# Altium schematic sheet ECL_Fanout.SchDoc
size A4; ApprovedBy: Mateusz Kowalik; CheckedBy: Mateusz Kowalik; Author: Mateusz Kowalik; CompanyName: InMotion Labs sp. z o.o.; DrawnBy: Mateusz Kowalik; Engineer: Mateusz Kowalik; Organization: InMotion Labs sp. z o.o.; Address1: Rydlówka 5A; Address2: 30-363 Kraków; Address4: Poland; Revision: Rev 0; SheetNumber: 14; SheetTotal: 16
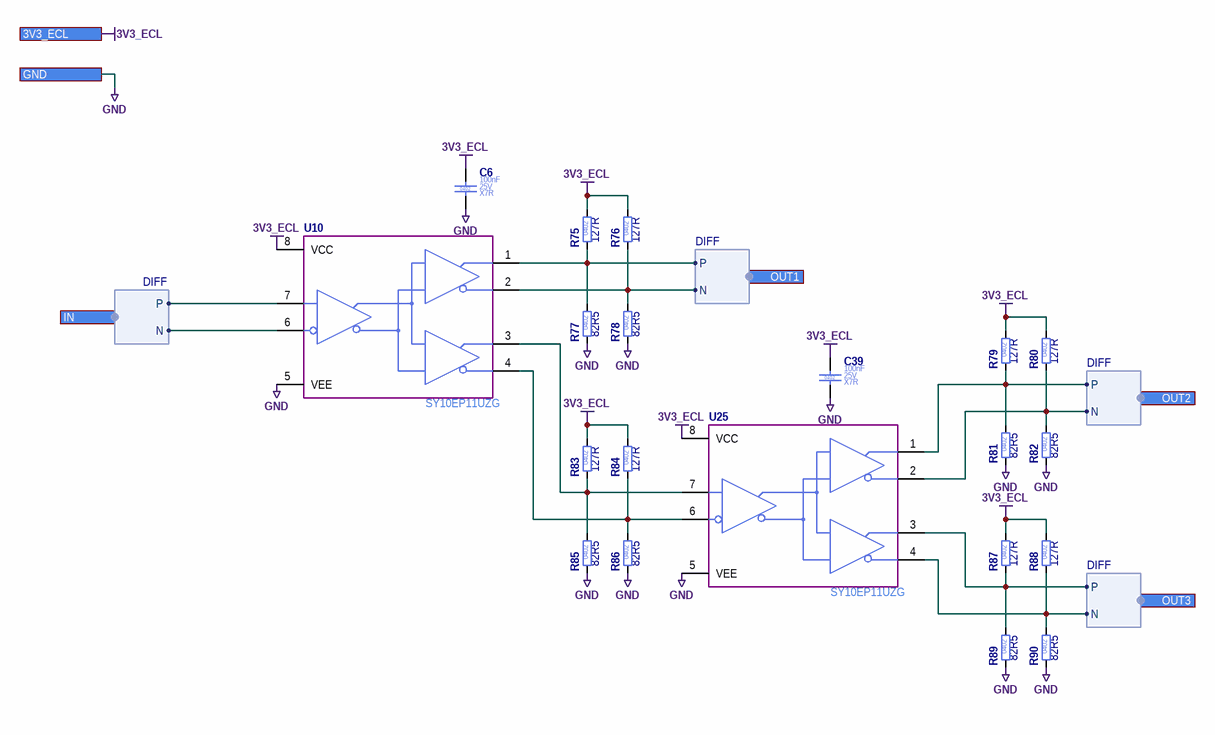
[diagram p0: ECL_Fanout.SchDoc]

## Parts
C6  Case/Package: 0402  Voltage Rating (DC): 25V  Dielectric: X7R  Capacitance: 100nF  [C_0402_1005]  (hidden comment: C_100NF_25V_X7R_0402_10)
C39  Case/Package: 0402  Voltage Rating (DC): 25V  Dielectric: X7R  Capacitance: 100nF  [C_0402_1005]  (hidden comment: C_100NF_25V_X7R_0402_10)
R75  Resistance: 127R  Case/Package: 0402  [R_0402_1005]  (hidden comment: R_127R_0402_1)
R76  Resistance: 127R  Case/Package: 0402  [R_0402_1005]  (hidden comment: R_127R_0402_1)
R77  Resistance: 82R5  Case/Package: 0402  [R_0402_1005]  (hidden comment: R_82R5_0402_1)
R78  Resistance: 82R5  Case/Package: 0402  [R_0402_1005]  (hidden comment: R_82R5_0402_1)
R79  Resistance: 127R  Case/Package: 0402  [R_0402_1005]  (hidden comment: R_127R_0402_1)
R80  Resistance: 127R  Case/Package: 0402  [R_0402_1005]  (hidden comment: R_127R_0402_1)
R81  Resistance: 82R5  Case/Package: 0402  [R_0402_1005]  (hidden comment: R_82R5_0402_1)
R82  Resistance: 82R5  Case/Package: 0402  [R_0402_1005]  (hidden comment: R_82R5_0402_1)
R83  Resistance: 127R  Case/Package: 0402  [R_0402_1005]  (hidden comment: R_127R_0402_1)
R84  Resistance: 127R  Case/Package: 0402  [R_0402_1005]  (hidden comment: R_127R_0402_1)
R85  Resistance: 82R5  Case/Package: 0402  [R_0402_1005]  (hidden comment: R_82R5_0402_1)
R86  Resistance: 82R5  Case/Package: 0402  [R_0402_1005]  (hidden comment: R_82R5_0402_1)
R87  Resistance: 127R  Case/Package: 0402  [R_0402_1005]  (hidden comment: R_127R_0402_1)
R88  Resistance: 127R  Case/Package: 0402  [R_0402_1005]  (hidden comment: R_127R_0402_1)
R89  Resistance: 82R5  Case/Package: 0402  [R_0402_1005]  (hidden comment: R_82R5_0402_1)
R90  Resistance: 82R5  Case/Package: 0402  [R_0402_1005]  (hidden comment: R_82R5_0402_1)
U10  SY10EP11UZG  [SOIC127P600X170-8N]
U25  SY10EP11UZG  [SOIC127P600X170-8N]

## Ports
3V3_ECL, GND, IN (harness DIFF), OUT1 (harness DIFF), OUT2 (harness DIFF), OUT3 (harness DIFF)

## Harnesses
DIFF: P, N

## Nets
3V3_ECL: C6.1 C39.1 R75.2 R76.2 R79.2 R80.2 R83.2 R84.2 R87.2 R88.2 U10.8(VCC) U25.8(VCC) ; port 3V3_ECL
GND: C6.2 C39.2 R77.1 R78.1 R81.1 R82.1 R85.1 R86.1 R89.1 R90.1 U10.5(VEE) U25.5(VEE) ; port GND
NetR75_1: R75.1 R77.2 U10.1(Q0) ; port OUT1.P
NetR76_1: R76.1 R78.2 U10.2(/Q0) ; port OUT1.N
NetR79_1: R79.1 R81.2 U25.1(Q0) ; port OUT2.P
NetR80_1: R80.1 R82.2 U25.2(/Q0) ; port OUT2.N
NetR83_1: R83.1 R85.2 U10.3(Q1) U25.7(D)
NetR84_1: R84.1 R86.2 U10.4(~{Q1}) U25.6(~{D})
NetR87_1: R87.1 R89.2 U25.3(Q1) ; port OUT3.P
NetR88_1: R88.1 R90.2 U25.4(~{Q1}) ; port OUT3.N
NetU10_6: U10.6(~{D}) ; port IN.N
NetU10_7: U10.7(D) ; port IN.P

## Notes on the sheet
- Title
- Size:
- Date:
- A4

## Library data of the parts
C6 C39 = C_100NF_25V_X7R_0402_10: Ceramic Capacitor; Manufacturer Part Number: EMK105B7104KV-F; Manufacturer: Taiyo Yuden; Value: 100nF; Tolerance: 10%; Part Number: C_100NF_25V_X7R_0402_10; Mount: Surface Mount; Height: 500um; HelpURL: https://pl.mouser.com/datasheet/2/396/mlcc02_e-1307760.pdf; RoHS: Compliant; Max Operating Temperature: 125°C; Status: AK; Supplier 1: Mouser; Supplier Part Number 1: 963-EMK105B7104KV-F
R75 R76 R79 R80 R83 R84 R87 R88 = R_127R_0402_1: Thick Film Resistor; Manufacturer: Yageo; Manufacturer Part Number: RC0402FR-07127RL; Value: 127R; Tolerance: 1%; Voltage Rating (DC): 50V; Power Rating: 63mW; Stats: MK; Part Number: R_127R_0402_1; Mount: Surface Mount; Height: 350um; HelpURL: https://pl.mouser.com/datasheet/2/447/PYu_RC_Group_51_RoHS_L_10-1664068.pdf; RoHS: Compliant; Max Operating Temperature: 155°C; Supplier 1: Mouser; Supplier Part Number 1: 603-RC0402FR-07127RL
R77 R78 R81 R82 R85 R86 R89 R90 = R_82R5_0402_1: Thick Film Resistor; Manufacturer: Yageo; Manufacturer Part Number: RC0402FR-0782R5L; Value: 82R5; Tolerance: 1%; Voltage Rating (DC): 50V; Power Rating: 63mW; Stats: MK; Part Number: R_82R5_0402_1; Mount: Surface Mount; Height: 350um; HelpURL: https://pl.mouser.com/datasheet/2/447/PYu-RC_Group_51_RoHS_L_10-1527934.pdf; RoHS: Compliant; Max Operating Temperature: 155°C; Supplier 1: Mouser; Supplier Part Number 1: 603-RC0402FR-0782R5L
U10 U25 = SY10EP11UZG: 1:2 PECL Fanout Buffer; Manufacturer: Microchip; Max Output Current: 100mA; Marking: Z8-1; Max Supply Voltage: 3.6V; Min Supply Voltage: 3.0V; Part Number: SY10EP11UZG; Case/Package: SOIC8; Mount: Surface Mount; Height: 1.75mm; HelpURL: https://datasheet.octopart.com/SY10EP11UZG-Microchip-datasheet-39498.pdf; Max Operating Temperature: 85°C; RoHS: Compliant; Status: MK; Manufacturer Part Number: SY10EP11UZG; Supplier 1: Mouser; Supplier Part Number 1: 998-SY10EP11UZG